# EAGLE schematic EquisatSimulatorV1 (EAGLE 7.7.0)
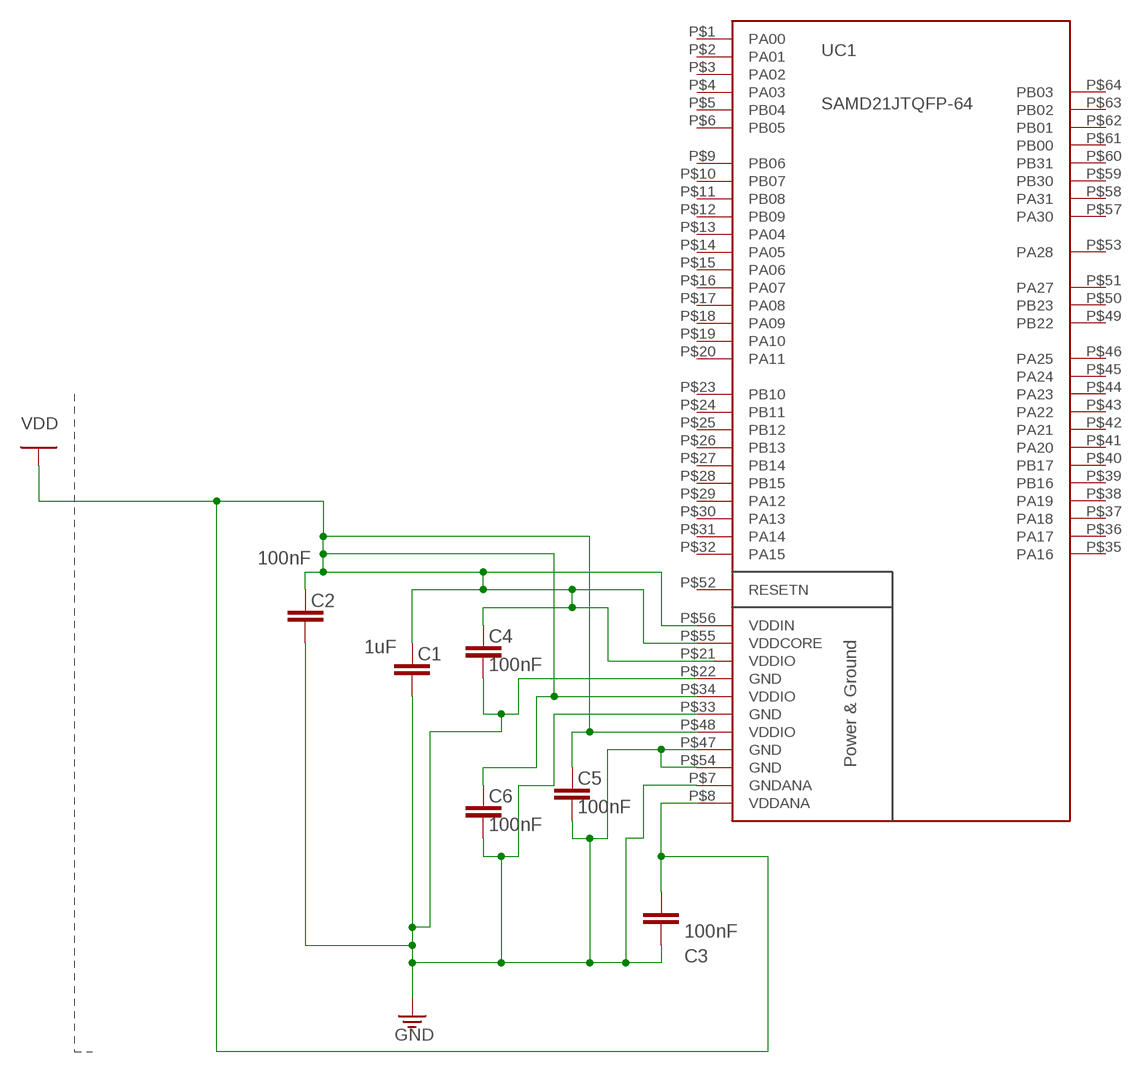
[diagram p0: schematic, sheet 1]

## Parts
C1  1uF  CAP0805  [0805]
C2  100nF  CAP0805  [0805]
C3  100nF  CAP0805  [0805]
C4  100nF  CAP0805  [0805]
C5  100nF  CAP0805  [0805]
C6  100nF  CAP0805  [0805]
UC1  SAMD21JTQFP-64  [TQFP-64]

## Nets
GND: C1.2 C2.2 C3.2 C4.2 C5.2 C6.2 UC1.P$7(GNDANA) UC1.P$22(GND) UC1.P$33(GND)
N$11: UC1.P$47(GND) UC1.P$54(GND)
VDD: C1.1 C2.1 C3.1 C4.1 C5.1 C6.1 UC1.P$8(VDDANA) UC1.P$34(VDDIO) UC1.P$48(VDDIO) UC1.P$55(VDDCORE) UC1.P$56(VDDIN)
Unconnected: UC1.P$1(PA00) UC1.P$2(PA01) UC1.P$3(PA02) UC1.P$4(PA03) UC1.P$5(PB04) UC1.P$6(PB05) UC1.P$9(PB06) UC1.P$10(PB07) UC1.P$11(PB08) UC1.P$12(PB09) UC1.P$13(PA04) UC1.P$14(PA05) UC1.P$15(PA06) UC1.P$16(PA07) UC1.P$17(PA08) UC1.P$18(PA09) UC1.P$19(PA10) UC1.P$20(PA11) UC1.P$23(PB10) UC1.P$24(PB11) UC1.P$25(PB12) UC1.P$26(PB13) UC1.P$27(PB14) UC1.P$28(PB15) UC1.P$29(PA12) UC1.P$30(PA13) UC1.P$31(PA14) UC1.P$32(PA15) UC1.P$35(PA16) UC1.P$36(PA17) UC1.P$37(PA18) UC1.P$38(PA19) UC1.P$39(PB16) UC1.P$40(PB17) UC1.P$41(PA20) UC1.P$42(PA21) UC1.P$43(PA22) UC1.P$44(PA23) UC1.P$45(PA24) UC1.P$46(PA25) UC1.P$49(PB22) UC1.P$50(PB23) UC1.P$51(PA27) UC1.P$52(RESETN) UC1.P$53(PA28) UC1.P$57(PA30) UC1.P$58(PA31) UC1.P$59(PB30) UC1.P$60(PB31) UC1.P$61(PB00) UC1.P$62(PB01) UC1.P$63(PB02) UC1.P$64(PB03)

## Power pins joined to a net without a drawn wire
VDDIO: UC1.P$21(VDDIO)

## Library data of the parts
C1-C6 = BrownSpaceEngineering:CAP: Capacitor
UC1 = BrownSpaceEngineering:SAMD21J